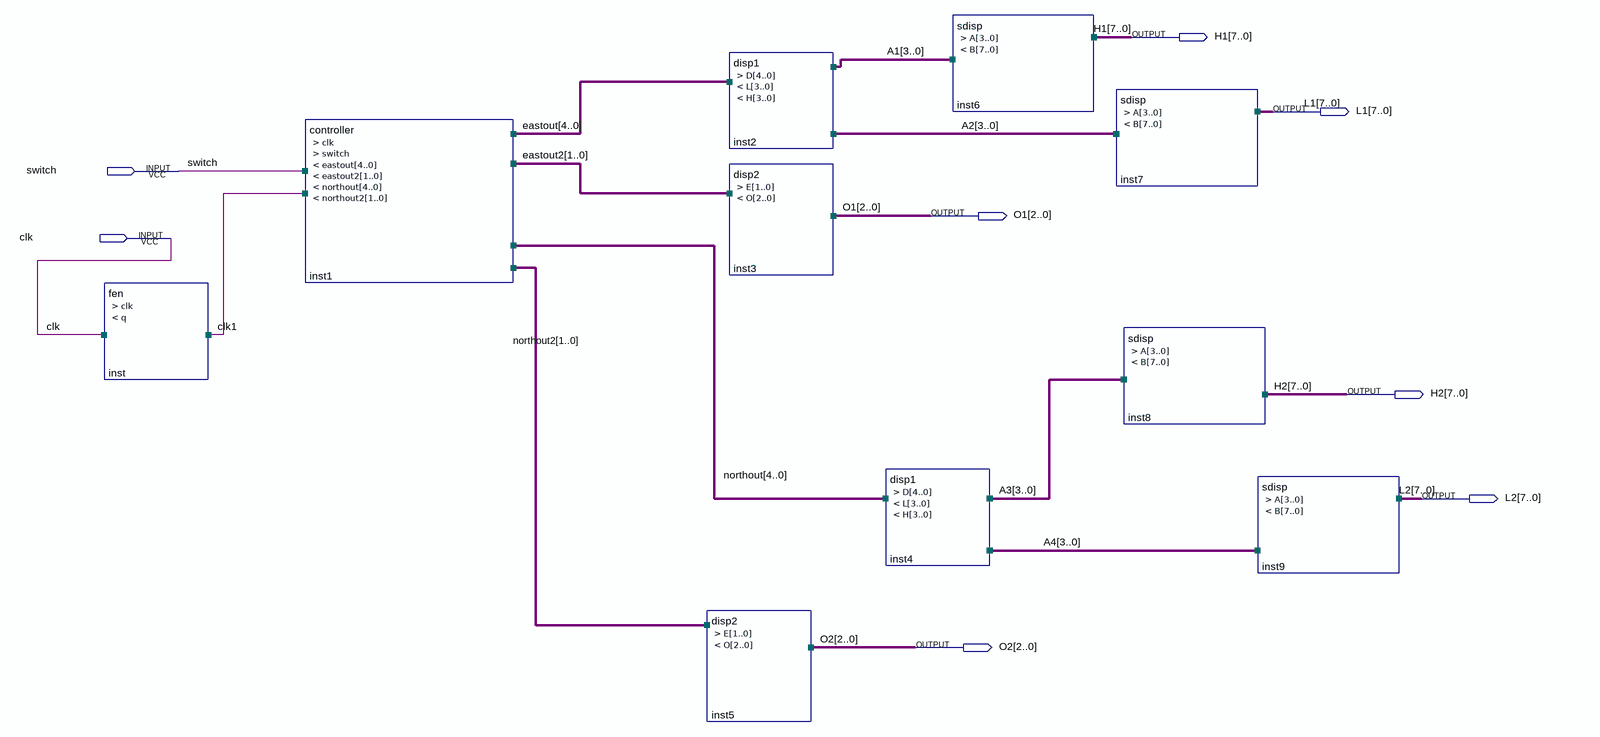
[diagram p0: schematic sheet]
// Quartus schematic traffic_lights.bdf as structural Verilog: 10 symbols, 8 pins
module traffic_lights (
  input  switch,
  input  clk,
  output [7:0] H1,
  output [7:0] L1,
  output [2:0] O1,
  output [7:0] H2,
  output [7:0] L2,
  output [2:0] O2
);

  wire clk1;
  wire [1:0] eastout2, northout2;
  wire [3:0] A1, A2, A3, A4;
  wire [4:0] eastout, northout;

  fen inst (.clk(clk), .q(clk1));
  controller inst1 (
    .clk(clk1), .switch(switch), .eastout(eastout), .eastout2(eastout2), .northout(northout),
    .northout2(northout2));
  disp1 inst2 (.D(eastout), .L(A2), .H(A1));
  disp2 inst3 (.E(eastout2), .O(O1));
  disp2 inst5 (.E(northout2), .O(O2));
  disp1 inst4 (.D(northout), .L(A4), .H(A3));
  sdisp inst6 (.A(A1), .B(H1));
  sdisp inst7 (.A(A2), .B(L1));
  sdisp inst8 (.A(A3), .B(H2));
  sdisp inst9 (.A(A4), .B(L2));
endmodule
